# Altium project WELDER.PrjPcb
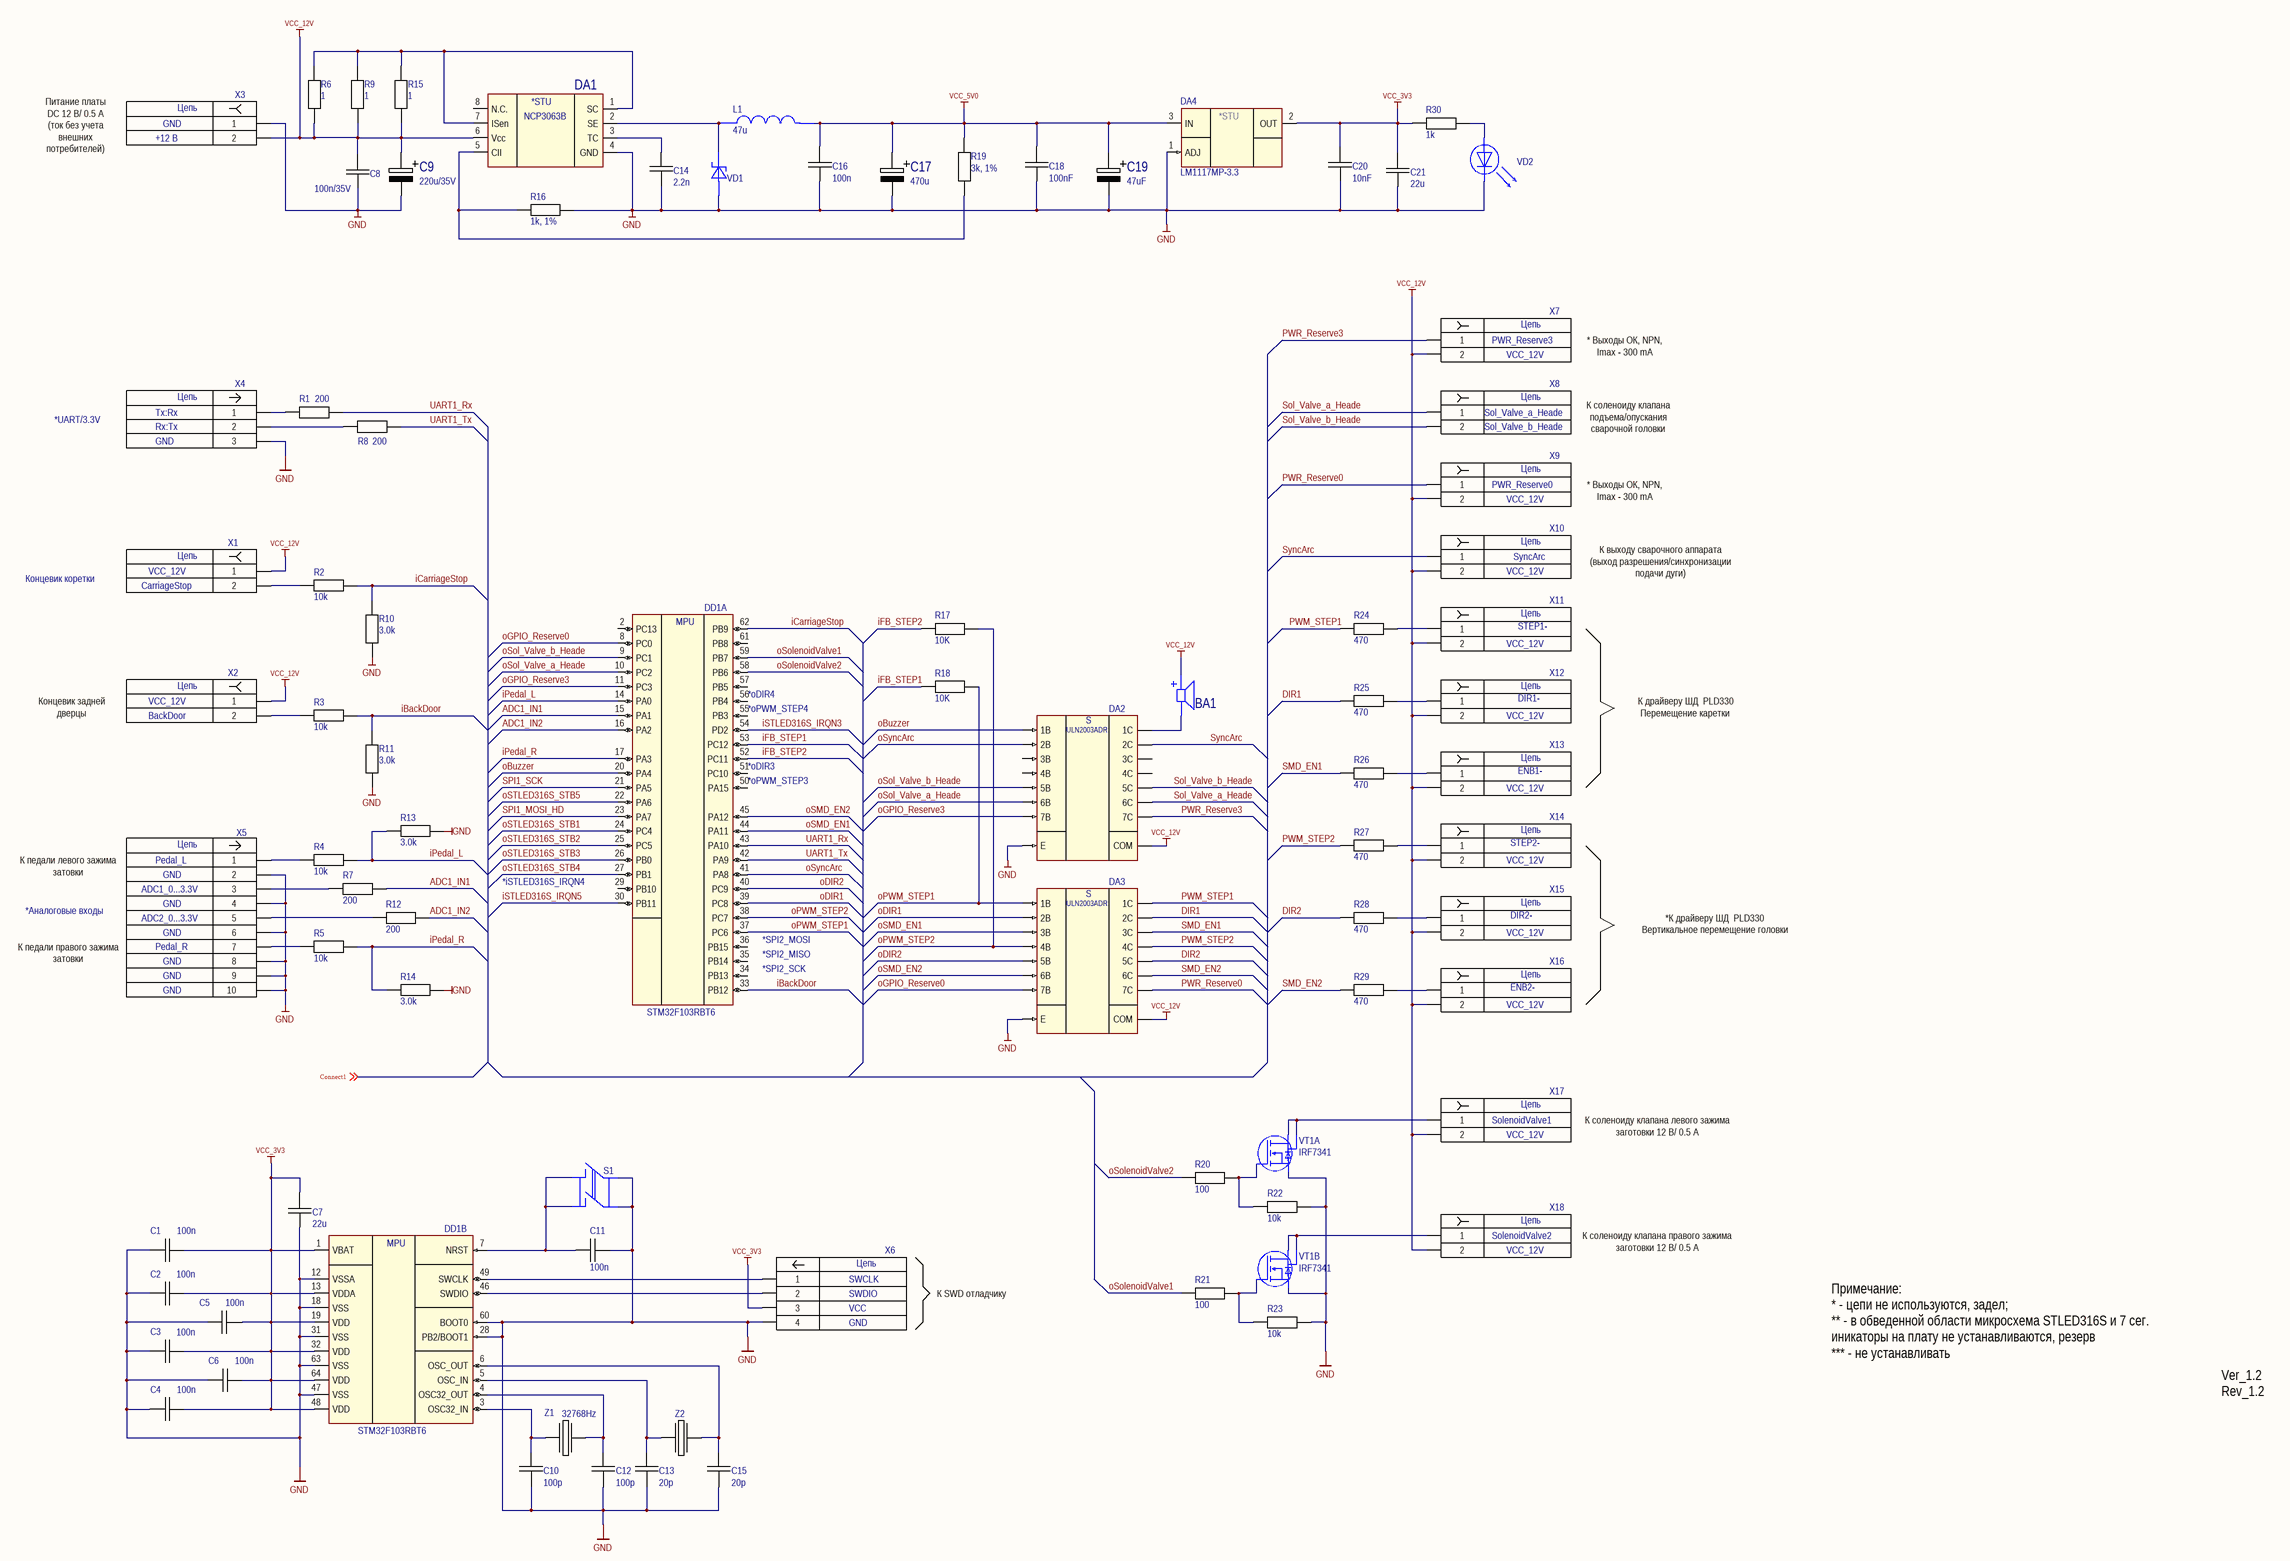
[diagram p0: Sheet1.SchDoc]
3 sheets, 154 parts. Net scope: global (net labels, ports and power ports of the same name join across sheets).
Board file: PCB1.PcbDoc
Sheets:
  Sheet1.SchDoc
  Sheet2.SchDoc
  Sheet3.SchDoc

## Sheet Sheet1.SchDoc
size 840 x 594 mm; Scale: 1:1; Разраб.: Тимофеев; Обозначение документа: 0000-00-00-01 Э3; Пров.: Тимофеев; Утв.: Тимофеев; Номер листа: 1; Общее количество листов: 2; Наименование организации: TSL; Перв. применение: 5759-05-12-20 УП6359; Наименование изделия 1: WELDER; Наименование изделия 2: Схема электрическая; Наименование изделия 3: принципиальная; Нач. отд.: Нач. отд.; Фамилия нач. отд.: Тимофеев

### Parts
BA1  Buzzer_HCM1212A  [Buzzer_HCM1212A]  (value not drawn)
C1  100n  [Capacitor_0805]
C2  100n  [Capacitor_0805]
C3  100n  [Capacitor_0805]
C4  100n  [Capacitor_0805]
C5  100n  [Capacitor_0805]
C6  100n  [Capacitor_0805]
C7  22u  [CAPACITOR_1206]
C8  100n/35V  [Capacitor_0805]
C9  220u/35V  [Capacitor_Electrolit_6.3x11]
C10  100p  [Capacitor_0805]  (no BOM)
C11  100n  [Capacitor_0805]
C12  100p  [Capacitor_0805]  (no BOM)
C13  20p  [Capacitor_0805]
C14  2.2n  [Capacitor_0805]
C15  20p  [Capacitor_0805]
C16  100n  [Capacitor_0805]
C17  470u  [Capacitor_Electrolit_6.3x11]
C18  100nF  [Capacitor_0805]
C19  47uF  [Capacitor_Electrolit_6.3x11]
C20  10nF  [Capacitor_0805]
C21  22u  [CAPACITOR_1206]
DA1  NCP3063B  [SOIC8]  (value not drawn)
DA2  ULN2003  [MCP3208_SOIC16]  (value not drawn)
DA3  ULN2003  [MCP3208_SOIC16]  (value not drawn)
DA4  LM1117MP-3.3  [NCP1117_SOT223]
DD1  STM32F103RBT6  [STM32F103RBT6_LQFP64]  (value not drawn)  (parts A,B of 2)
L1  47u  [INDUCTOR_CDRH8D28]
R1  200  [RESISTOR_SMD0805]
R2  10k  [RESISTOR_SMD0805]
R3  10k  [RESISTOR_SMD0805]
R4  10k  [RESISTOR_SMD0805]
R5  10k  [RESISTOR_SMD0805]
R6  1  [RESISTOR_SMD0805]
R7  200  [RESISTOR_SMD0805]
R8  200  [RESISTOR_SMD0805]
R9  1  [RESISTOR_SMD0805]
R10  3.0k  [RESISTOR_SMD0805]
R11  3.0k  [RESISTOR_SMD0805]
R12  200  [RESISTOR_SMD0805]
R13  3.0k  [RESISTOR_SMD0805]
R14  3.0k  [RESISTOR_SMD0805]
R15  1  [RESISTOR_SMD0805]
R16  1k, 1%  [RESISTOR_SMD0805]
R17  10K  [RESISTOR_SMD0805]
R18  10K  [RESISTOR_SMD0805]
R19  3k, 1%  [RESISTOR_SMD0805]
R20  100  [RESISTOR_SMD0805]
R21  100  [RESISTOR_SMD0805]
R22  10k  [RESISTOR_SMD0805]
R23  10k  [RESISTOR_SMD0805]
R24  470  [RESISTOR_SMD0805]
R25  470  [RESISTOR_SMD0805]
R26  470  [RESISTOR_SMD0805]
R27  470  [RESISTOR_SMD0805]
R28  470  [RESISTOR_SMD0805]
R29  470  [RESISTOR_SMD0805]
R30  1k  [RESISTOR_SMD0805]
S1  DTS-26 12x12x9.5  [Tact Switch_DTS-26_12x12x95]  (value not drawn)
VD1  STPS1L30A  [DIODE_STPS1L30A]  (value not drawn)
VD2  LED_FYL-3014GD1A  [LED_ FYL-3014GD1A]  (value not drawn)
VT1  IRF7341  [IRF7341_SO-8/SOIC-8]  (parts A,B of 2)
X1  Connector_DG306-5.0-02P  [CONNECTOR_DG306-5.0-02P]  (value not drawn)
X2  Connector_DG306-5.0-02P  [CONNECTOR_DG306-5.0-02P]  (value not drawn)
X3  Connector_DG306-5.0-02P  [CONNECTOR_DG306-5.0-02P]  (value not drawn)
X4  Connector_PLS-3  [CONNECTOR_PLS-3]  (value not drawn)
X5  Connector_PLD-10  [CONNECTOR_PLD-10]  (value not drawn)
X6  Connector_PLS-4  [CONNECTOR_PLS-4]  (value not drawn)
X7  Connector_DG306-5.0-02P  [CONNECTOR_DG306-5.0-02P]  (value not drawn)
X8  Connector_DG306-5.0-02P  [CONNECTOR_DG306-5.0-02P]  (value not drawn)
X9  Connector_DG306-5.0-02P  [CONNECTOR_DG306-5.0-02P]  (value not drawn)
X10  Connector_DG306-5.0-02P  [CONNECTOR_DG306-5.0-02P]  (value not drawn)
X11  Connector_DG306-5.0-02P  [CONNECTOR_DG306-5.0-02P]  (value not drawn)
X12  Connector_DG306-5.0-02P  [CONNECTOR_DG306-5.0-02P]  (value not drawn)
X13  Connector_DG306-5.0-02P  [CONNECTOR_DG306-5.0-02P]  (value not drawn)
X14  Connector_DG306-5.0-02P  [CONNECTOR_DG306-5.0-02P]  (value not drawn)
X15  Connector_DG306-5.0-02P  [CONNECTOR_DG306-5.0-02P]  (value not drawn)
X16  Connector_DG306-5.0-02P  [CONNECTOR_DG306-5.0-02P]  (value not drawn)
X17  Connector_DG306-5.0-02P  [CONNECTOR_DG306-5.0-02P]  (value not drawn)
X18  Connector_DG306-5.0-02P  [CONNECTOR_DG306-5.0-02P]  (value not drawn)
Z1  32768Hz  [Quartz_32768kHz]  (no BOM)
Z2  Quartz_KX-9A  [Quartz_KX-9]  (value not drawn)

### Nets
GND: C1.1 C2.1 C3.1 C4.1 C5.2 C6.1 C7.2 C8.2 C9.2 C10.1 C11.1 C12.1 C13.1 C14.1 C15.1 C16.2 C17.2 C18.2 C19.2 C20.2 C21.2 DA1.4(GND) DA2.8(E) DA3.8(E) DA4.1(ADJ) DD1.12(VSSA) DD1.18(VSS) DD1.28(PB2/BOOT1) DD1.31(VSS) DD1.47(VSS) DD1.60(BOOT0) DD1.63(VSS) R10.1 R11.1 R13.1 R14.1 R16.1 R22.1 R23.1 S1.3 S1.4 VD1.2 VD2.1 VT1.1 VT1.3 X3.1 X4.3 X5.2 X5.4 X5.6 X5.8 X5.9 X5.10 X6.4
VCC_3V3: C1.2 C2.2 C3.2 C4.2 C5.1 C6.2 C7.1 C20.1 C21.1 DA4.2(OUT) DD1.1(VBAT) DD1.13(VDDA) DD1.19(VDD) DD1.32(VDD) DD1.48(VDD) DD1.64(VDD) R30.2 X6.3
VCC_5V0: C16.1 C17.1 C18.1 C19.1 DA4.3(IN) L1.2 R19.1
VCC_12V: BA1.1 C8.1 C9.1 DA1.6(Vcc) DA2.9(COM) DA3.9(COM) R6.2 R9.2 R15.2 X1.1 X2.1 X3.2 X7.2 X9.2 X10.2 X11.2 X12.2 X13.2 X14.2 X15.2 X16.2 X17.2 X18.2
ADC1_IN1: DD1.15(PA1) R7.1
ADC1_IN2: DD1.16(PA2) R12.1
DIR1: DA3.15(2C) R25.2
DIR2: DA3.12(5C) R28.2
iBackDoor: DD1.33(PB12) R3.1 R11.2
iCarriageStop: DD1.62(PB9) R2.1 R10.2
iFB_STEP1: DD1.53(PC12) R18.1
iFB_STEP2: DD1.52(PC11) R17.1
iPedal_L: DD1.14(PA0) R4.1 R13.2
iPedal_R: DD1.17(PA3) R5.1 R14.2
iSTLED316S_IRQN3: DD1.54(PD2)
iSTLED316S_IRQN5: DD1.30(PB11)
oBuzzer: DA2.1(1B) DD1.20(PA4)
oDIR1: DA3.2(2B) DD1.39(PC8)
oDIR2: DA3.5(5B) DD1.40(PC9)
oGPIO_Reserve0: DA3.7(7B) DD1.8(PC0)
oGPIO_Reserve3: DA2.7(7B) DD1.11(PC3)
oPWM_STEP1: DA3.1(1B) DD1.37(PC6) R18.2
oPWM_STEP2: DA3.4(4B) DD1.38(PC7) R17.2
oSMD_EN1: DA3.3(3B) DD1.44(PA11)
oSMD_EN2: DA3.6(6B) DD1.45(PA12)
oSol_Valve_a_Heade: DA2.6(6B) DD1.10(PC2)
oSol_Valve_b_Heade: DA2.5(5B) DD1.9(PC1)
oSolenoidValve1: DD1.59(PB7) R21.2
oSolenoidValve2: DD1.58(PB6) R20.2
oSTLED316S_STB1: DD1.24(PC4)
oSTLED316S_STB2: DD1.25(PC5)
oSTLED316S_STB3: DD1.26(PB0)
oSTLED316S_STB4: DD1.27(PB1)
oSTLED316S_STB5: DD1.22(PA6)
oSyncArc: DA2.2(2B) DD1.41(PA8)
PWM_STEP1: DA3.16(1C) R24.2
PWM_STEP2: DA3.13(4C) R27.2
PWR_Reserve0: DA3.10(7C) X9.1
PWR_Reserve3: DA2.10(7C) X7.1
SMD_EN1: DA3.14(3C) R26.2
SMD_EN2: DA3.11(6C) R29.2
Sol_Valve_a_Heade: DA2.11(6C) X8.1
Sol_Valve_b_Heade: DA2.12(5C) X8.2
SPI1_MOSI_HD: DD1.23(PA7)
SPI1_SCK: DD1.21(PA5)
SyncArc: DA2.15(2C) X10.1
UART1_Rx: DD1.43(PA10) R1.1
UART1_Tx: DD1.42(PA9) R8.1
NetBA1_2: BA1.2 DA2.16(1C)
NetC10_2: C10.2 DD1.3(OSC32_IN) Z1.1
NetC11_2: C11.2 DD1.7(NRST) S1.1 S1.2
NetC12_2: C12.2 DD1.4(OSC32_OUT) Z1.2
NetC13_2: C13.2 DD1.5(OSC_IN) Z2.1
NetC14_2: C14.2 DA1.3(TC)
NetC15_2: C15.2 DD1.6(OSC_OUT) Z2.3
NetDA1_1: DA1.1(SC) DA1.7(ISen) R6.1 R9.1 R15.1
NetDA1_2: DA1.2(SE) L1.1 VD1.1
NetDA1_5: DA1.5(CII) R16.2 R19.2
NetDD1_46: DD1.46(SWDIO) X6.2
NetDD1_49: DD1.49(SWCLK) X6.1
NetR1_2: R1.2 X4.1
NetR2_2: R2.2 X1.2
NetR3_2: R3.2 X2.2
NetR4_2: R4.2 X5.1
NetR5_2: R5.2 X5.7
NetR7_2: R7.2 X5.3
NetR8_2: R8.2 X4.2
NetR12_2: R12.2 X5.5
NetR20_1: R20.1 R22.2 VT1.2
NetR21_1: R21.1 R23.2 VT1.4
NetR24_1: R24.1 X11.1
NetR25_1: R25.1 X12.1
NetR26_1: R26.1 X13.1
NetR27_1: R27.1 X14.1
NetR28_1: R28.1 X15.1
NetR29_1: R29.1 X16.1
NetR30_1: R30.1 VD2.2
NetVT1_5: VT1.5 VT1.6 X18.1
NetVT1_7: VT1.7 VT1.8 X17.1

Not connected (* = marked no-connect by the designer): DA1 8(N.C.); DA2 3(3B) 4(4B) 13(4C) 14(3C); DD1 2(PC13) 29(PB10) 34(PB13) 35(PB14) 36(PB15) 50(PA15) 51(PC10) 55(PB3) 56(PB4) 57(PB5) 61(PB8)

### Notes on the sheet
- Питание платы
  DC 12 В/ 0.5 А
  (ток без учета внешних потребителей)
- +12 В
- GND
- PWR_Reserve3
- VCC_12V
- * Выходы ОК, NPN,
  Imax - 300 mA
- *UART/3.3V
- Rx:Tx
- Tx:Rx
- Sol_Valve_a_Heade
- Sol_Valve_b_Heade
- К соленоиду клапана подъема/опускания сварочной головки
- PWR_Reserve0
- SyncArc
- Концевик коретки
- CarriageStop
- К выходу сварочного аппарата
  (выход разрешения/синхронизации подачи дуги)
- STEP1-
- (near DD1) *oDIR4
- DIR1-
- Концевик задней дверцы
- BackDoor
- (near DD1) *oPWM_STEP4
- К драйверу ШД  PLD330
  Перемещение каретки
- (near DD1) *oDIR3
- ENB1-
- (near DD1) *oPWM_STEP3
- STEP2-
- К педали левого зажима затовки
- Pedal_L
- *iSTLED316S_IRQN4
- *Аналоговые входы
- ADC1_0...3.3V
- ADC2_0...3.3V
- DIR2-
- К педали правого зажима затовки
- Pedal_R
- (near DD1) *SPI2_MOSI
- (near DD1) *SPI2_MISO
- *К драйверу ШД  PLD330
  Вертикальное перемещение головки
- (near DD1) *SPI2_SCK
- ENB2-
- SolenoidValve1
- К соленоиду клапана левого зажима заготовки 12 В/ 0.5 А
- SolenoidValve2
- К соленоиду клапана правого зажима заготовки 12 В/ 0.5 А
- SWCLK
- SWDIO
- VCC
- К SWD отладчику
- Примечание:
  * - цепи не используются, задел;
  ** - в обведенной области микросхема STLED316S и 7 сег. иникаторы на плату не устанавливаются, резерв
  *** - не устанавливать
- Ver_1.2
  Rev_1.2
- Перв. примен.
- Справ. №
- Подп. и дата
- Инв. № дубл.
- Взам. инв. №
- Разраб.
- Изм.
- Лист
- № докум.
- Подп.
- Дата
- Лит.
- Масса
- Масштаб
- Пров.
- Т.контр.
- Листов
- Инв. № подл.
- Утв.
- Н.контр.
- Копировал
- Формат А1
- (in symbol Connector_DG306-5.0-02P) Цепь
- (in symbol Connector_PLD-10) Цепь
- (in symbol Connector_PLS-3) Цепь
- (in symbol Connector_PLS-4) Цепь
- (in symbol LM1117MP-3.3) *STU
- (in symbol NCP3063B) *STU
- (in symbol STM32F103RBT6, part A) MPU
- (in symbol STM32F103RBT6, part B) MPU
- (in symbol ULN2003) S; ULN2003ADR

### Library data of the parts
C1-C6 C8 C10-C16 C18 C20 = Capacitor_0805
C7 C21 = Capacitor_1206
C9 C17 C19 = Capacitor+_6.3x11
L1 = Indluctor_CDRH8D28
R1-R30 = Resistor_0805
S1 = Tact_Switch_DTS-26_12x12x95
VD1 = Diode_STPS1L30A
Z1 = Quartz_32678Hz

## Sheet Sheet2.SchDoc
size 840 x 594 mm; Scale: 1:1; Разраб.: Тимофеев; Обозначение документа: 5759-05-12-20 УП6359 Э3; Пров.: Никоноров; Утв.: Токарев; Наименование организации: ООО "ПО"Зарница"; Перв. применение: 5759-05-12-20 УП6359; Наименование изделия 1: Uni_mp3_v2_00; Наименование изделия 2: Схема электрическая; Наименование изделия 3: принципиальная; Нач. отд.: Нач. отд.; Фамилия нач. отд.: Никоноров
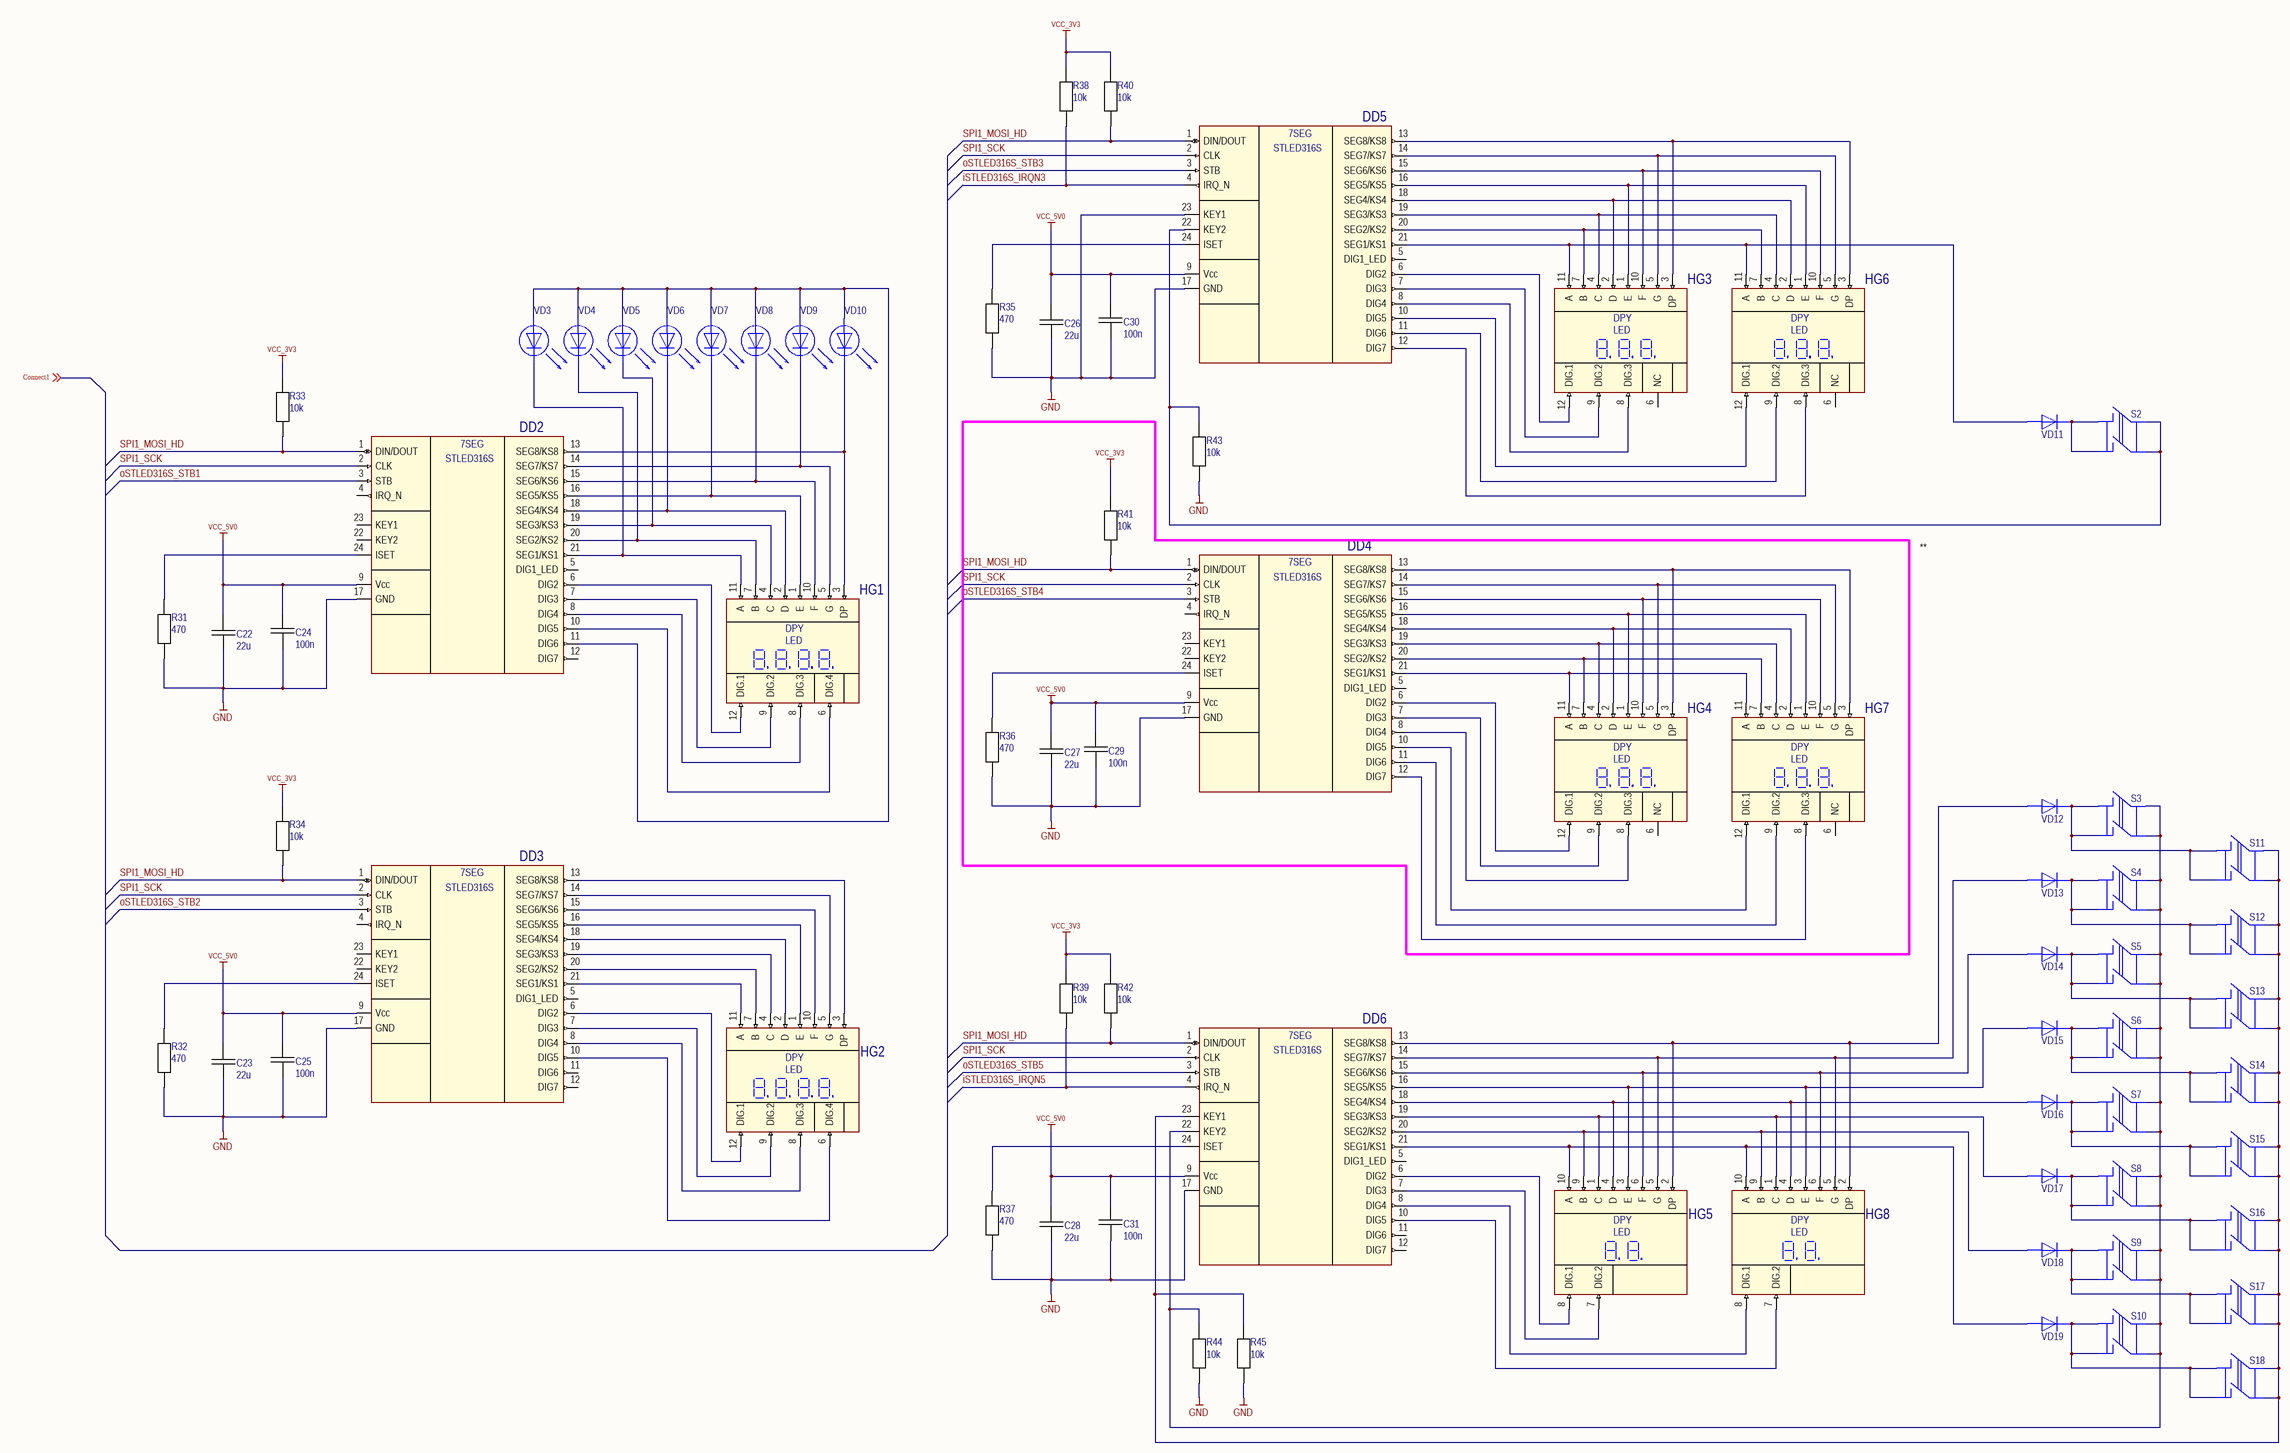
[diagram p1: Sheet2.SchDoc]

### Parts
C22  22u  [CAPACITOR_1206]
C23  22u  [CAPACITOR_1206]
C24  100n  [Capacitor_0805]
C25  100n  [Capacitor_0805]
C26  22u  [CAPACITOR_1206]
C27  22u  [CAPACITOR_1206]
C28  22u  [CAPACITOR_1206]
C29  100n  [Capacitor_0805]
C30  100n  [Capacitor_0805]
C31  100n  [Capacitor_0805]
DD2  STLED316S  [SO-24]  (value not drawn)
DD3  STLED316S  [SO-24]  (value not drawn)
DD4  STLED316S  [SO-24]  (value not drawn)
DD5  STLED316S  [SO-24]  (value not drawn)
DD6  STLED316S  [SO-24]  (value not drawn)
HG1  FYQ-5641BG-21  [FYQ-5641BG-21]  (value not drawn)
HG2  FYQ-5641BG-21  [FYQ-5641BG-21]  (value not drawn)
HG3  FYT-5631Bx  [FYT-5631Bx]  (value not drawn)
HG4  FYT-5631Bx  (value not drawn)
HG5  FYD-5621Bx  [FYD-5621Bx]  (value not drawn)
HG6  FYT-5631Bx  [FYT-5631Bx]  (value not drawn)
HG7  FYT-5631Bx  (value not drawn)
HG8  FYD-5621Bx  [FYD-5621Bx]  (value not drawn)
R31  470  [RESISTOR_SMD0805]
R32  470  [RESISTOR_SMD0805]
R33  10k  [RESISTOR_SMD0805]
R34  10k  [RESISTOR_SMD0805]
R35  470  [RESISTOR_SMD0805]
R36  470  [RESISTOR_SMD0805]
R37  470  [RESISTOR_SMD0805]
R38  10k  [RESISTOR_SMD0805]
R39  10k  [RESISTOR_SMD0805]
R40  10k  [RESISTOR_SMD0805]
R41  10k  [RESISTOR_SMD0805]
R42  10k  [RESISTOR_SMD0805]
R43  10k  [RESISTOR_SMD0805]
R44  10k  [RESISTOR_SMD0805]
R45  10k  [RESISTOR_SMD0805]
S2  DTS-26 12x12x9.5  [Tact Switch_DTS-26_12x12x95]  (value not drawn)
S3  DTS-26 12x12x9.5  [Tact Switch_DTS-26_12x12x95]  (value not drawn)
S4  DTS-26 12x12x9.5  [Tact Switch_DTS-26_12x12x95]  (value not drawn)
S5  DTS-26 12x12x9.5  [Tact Switch_DTS-26_12x12x95]  (value not drawn)
S6  DTS-26 12x12x9.5  [Tact Switch_DTS-26_12x12x95]  (value not drawn)
S7  DTS-26 12x12x9.5  [Tact Switch_DTS-26_12x12x95]  (value not drawn)
S8  DTS-26 12x12x9.5  [Tact Switch_DTS-26_12x12x95]  (value not drawn)
S9  DTS-26 12x12x9.5  [Tact Switch_DTS-26_12x12x95]  (value not drawn)
S10  DTS-26 12x12x9.5  [Tact Switch_DTS-26_12x12x95]  (value not drawn)
S11  DTS-26 12x12x9.5  [Tact Switch_DTS-26_12x12x95]  (value not drawn)
S12  DTS-26 12x12x9.5  [Tact Switch_DTS-26_12x12x95]  (value not drawn)
S13  DTS-26 12x12x9.5  [Tact Switch_DTS-26_12x12x95]  (value not drawn)
S14  DTS-26 12x12x9.5  [Tact Switch_DTS-26_12x12x95]  (value not drawn)
S15  DTS-26 12x12x9.5  [Tact Switch_DTS-26_12x12x95]  (value not drawn)
S16  DTS-26 12x12x9.5  [Tact Switch_DTS-26_12x12x95]  (value not drawn)
S17  DTS-26 12x12x9.5  [Tact Switch_DTS-26_12x12x95]  (value not drawn)
S18  DTS-26 12x12x9.5  [Tact Switch_DTS-26_12x12x95]  (value not drawn)
VD3  LED_FYL-3014GD1A  (value not drawn)
VD4  LED_FYL-3014GD1A  (value not drawn)
VD5  LED_FYL-3014GD1A  (value not drawn)
VD6  LED_FYL-3014GD1A  (value not drawn)
VD7  LED_FYL-3014GD1A  [LED_ FYL-3014GD1A]  (value not drawn)
VD8  LED_FYL-3014GD1A  [LED_ FYL-3014GD1A]  (value not drawn)
VD9  LED_FYL-3014GD1A  [LED_ FYL-3014GD1A]  (value not drawn)
VD10  LED_FYL-3014GD1A  [LED_ FYL-3014GD1A]  (value not drawn)
VD11  MMSD4148  [Diode_MMSD4148]  (value not drawn)
VD12  MMSD4148  [Diode_MMSD4148]  (value not drawn)
VD13  MMSD4148  [Diode_MMSD4148]  (value not drawn)
VD14  MMSD4148  [Diode_MMSD4148]  (value not drawn)
VD15  MMSD4148  [Diode_MMSD4148]  (value not drawn)
VD16  MMSD4148  [Diode_MMSD4148]  (value not drawn)
VD17  MMSD4148  [Diode_MMSD4148]  (value not drawn)
VD18  MMSD4148  [Diode_MMSD4148]  (value not drawn)
VD19  MMSD4148  [Diode_MMSD4148]  (value not drawn)

### Nets
GND: C22.2 C23.2 C24.1 C25.1 C26.2 C27.2 C28.2 C29.1 C30.1 C31.1 DD2.17(GND) DD3.17(GND) DD4.17(GND) DD5.17(GND) DD5.23(KEY1) DD6.17(GND) R31.1 R32.1 R35.1 R36.1 R37.1 R43.1 R44.1 R45.1
VCC_3V3: R33.2 R34.2 R38.2 R39.2 R40.2 R41.2 R42.2
VCC_5V0: C22.1 C23.1 C24.2 C25.2 C26.1 C27.1 C28.1 C29.2 C30.2 C31.2 DD2.9(Vcc) DD3.9(Vcc) DD4.9(Vcc) DD5.9(Vcc) DD6.9(Vcc)
iSTLED316S_IRQN3: DD5.4(IRQ_N) R38.1
iSTLED316S_IRQN5: DD6.4(IRQ_N) R39.1
oSTLED316S_STB1: DD2.3(STB)
oSTLED316S_STB2: DD3.3(STB)
oSTLED316S_STB3: DD5.3(STB)
oSTLED316S_STB4: DD4.3(STB)
oSTLED316S_STB5: DD6.3(STB)
SPI1_MOSI_HD: DD2.1(DIN/DOUT) DD3.1(DIN/DOUT) DD4.1(DIN/DOUT) DD5.1(DIN/DOUT) DD6.1(DIN/DOUT) R33.1 R34.1 R40.1 R41.1 R42.1
SPI1_SCK: DD2.2(CLK) DD3.2(CLK) DD4.2(CLK) DD5.2(CLK) DD6.2(CLK)
NetDD2_6: DD2.6(DIG2) HG1.12(DIG.1)
NetDD2_7: DD2.7(DIG3) HG1.9(DIG.2)
NetDD2_8: DD2.8(DIG4) HG1.8(DIG.3)
NetDD2_10: DD2.10(DIG5) HG1.6(DIG.4)
NetDD2_11: DD2.11(DIG6) VD3.2 VD4.2 VD5.2 VD6.2 VD7.2 VD8.2 VD9.2 VD10.2
NetDD2_13: DD2.13(SEG8/KS8) HG1.3(DP) VD10.1
NetDD2_14: DD2.14(SEG7/KS7) HG1.5(G) VD9.1
NetDD2_15: DD2.15(SEG6/KS6) HG1.10(F) VD8.1
NetDD2_16: DD2.16(SEG5/KS5) HG1.1(E) VD7.1
NetDD2_18: DD2.18(SEG4/KS4) HG1.2(D) VD6.1
NetDD2_19: DD2.19(SEG3/KS3) HG1.4(C) VD5.1
NetDD2_20: DD2.20(SEG2/KS2) HG1.7(B) VD4.1
NetDD2_21: DD2.21(SEG1/KS1) HG1.11(A) VD3.1
NetDD2_24: DD2.24(ISET) R31.2
NetDD3_6: DD3.6(DIG2) HG2.12(DIG.1)
NetDD3_7: DD3.7(DIG3) HG2.9(DIG.2)
NetDD3_8: DD3.8(DIG4) HG2.8(DIG.3)
NetDD3_10: DD3.10(DIG5) HG2.6(DIG.4)
NetDD3_13: DD3.13(SEG8/KS8) HG2.3(DP)
NetDD3_14: DD3.14(SEG7/KS7) HG2.5(G)
NetDD3_15: DD3.15(SEG6/KS6) HG2.10(F)
NetDD3_16: DD3.16(SEG5/KS5) HG2.1(E)
NetDD3_18: DD3.18(SEG4/KS4) HG2.2(D)
NetDD3_19: DD3.19(SEG3/KS3) HG2.4(C)
NetDD3_20: DD3.20(SEG2/KS2) HG2.7(B)
NetDD3_21: DD3.21(SEG1/KS1) HG2.11(A)
NetDD3_24: DD3.24(ISET) R32.2
NetDD4_6: DD4.6(DIG2) HG4.12(DIG.1)
NetDD4_7: DD4.7(DIG3) HG4.9(DIG.2)
NetDD4_8: DD4.8(DIG4) HG4.8(DIG.3)
NetDD4_10: DD4.10(DIG5) HG7.12(DIG.1)
NetDD4_11: DD4.11(DIG6) HG7.9(DIG.2)
NetDD4_12: DD4.12(DIG7) HG7.8(DIG.3)
NetDD4_13: DD4.13(SEG8/KS8) HG4.3(DP) HG7.3(DP)
NetDD4_14: DD4.14(SEG7/KS7) HG4.5(G) HG7.5(G)
NetDD4_15: DD4.15(SEG6/KS6) HG4.10(F) HG7.10(F)
NetDD4_16: DD4.16(SEG5/KS5) HG4.1(E) HG7.1(E)
NetDD4_18: DD4.18(SEG4/KS4) HG4.2(D) HG7.2(D)
NetDD4_19: DD4.19(SEG3/KS3) HG4.4(C) HG7.4(C)
NetDD4_20: DD4.20(SEG2/KS2) HG4.7(B) HG7.7(B)
NetDD4_21: DD4.21(SEG1/KS1) HG4.11(A) HG7.11(A)
NetDD4_24: DD4.24(ISET) R36.2
NetDD5_6: DD5.6(DIG2) HG3.12(DIG.1)
NetDD5_7: DD5.7(DIG3) HG3.9(DIG.2)
NetDD5_8: DD5.8(DIG4) HG3.8(DIG.3)
NetDD5_10: DD5.10(DIG5) HG6.12(DIG.1)
NetDD5_11: DD5.11(DIG6) HG6.9(DIG.2)
NetDD5_12: DD5.12(DIG7) HG6.8(DIG.3)
NetDD5_13: DD5.13(SEG8/KS8) HG3.3(DP) HG6.3(DP)
NetDD5_14: DD5.14(SEG7/KS7) HG3.5(G) HG6.5(G)
NetDD5_15: DD5.15(SEG6/KS6) HG3.10(F) HG6.10(F)
NetDD5_16: DD5.16(SEG5/KS5) HG3.1(E) HG6.1(E)
NetDD5_18: DD5.18(SEG4/KS4) HG3.2(D) HG6.2(D)
NetDD5_19: DD5.19(SEG3/KS3) HG3.4(C) HG6.4(C)
NetDD5_20: DD5.20(SEG2/KS2) HG3.7(B) HG6.7(B)
NetDD5_21: DD5.21(SEG1/KS1) HG3.11(A) HG6.11(A) VD11.2
NetDD5_22: DD5.22(KEY2) R43.2 S2.3 S2.4
NetDD5_24: DD5.24(ISET) R35.2
NetDD6_6: DD6.6(DIG2) HG5.8(DIG.1)
NetDD6_7: DD6.7(DIG3) HG5.7(DIG.2)
NetDD6_8: DD6.8(DIG4) HG8.8(DIG.1)
NetDD6_10: DD6.10(DIG5) HG8.7(DIG.2)
NetDD6_13: DD6.13(SEG8/KS8) HG5.2(DP) HG8.2(DP) VD12.2
NetDD6_14: DD6.14(SEG7/KS7) HG5.5(G) HG8.5(G) VD13.2
NetDD6_15: DD6.15(SEG6/KS6) HG5.6(F) HG8.6(F) VD14.2
NetDD6_16: DD6.16(SEG5/KS5) HG5.3(E) HG8.3(E) VD15.2
NetDD6_18: DD6.18(SEG4/KS4) HG5.4(D) HG8.4(D) VD16.2
NetDD6_19: DD6.19(SEG3/KS3) HG5.1(C) HG8.1(C) VD17.2
NetDD6_20: DD6.20(SEG2/KS2) HG5.9(B) HG8.9(B) VD18.2
NetDD6_21: DD6.21(SEG1/KS1) HG5.10(A) HG8.10(A) VD19.2
NetDD6_22: DD6.22(KEY2) R44.2 S3.3 S3.4 S4.3 S4.4 S5.3 S5.4 S6.3 S6.4 S7.3 S7.4 S8.3 S8.4 S9.3 S9.4 S10.3 S10.4
NetDD6_23: DD6.23(KEY1) R45.2 S11.3 S11.4 S12.3 S12.4 S13.3 S13.4 S14.3 S14.4 S15.3 S15.4 S16.3 S16.4 S17.3 S17.4 S18.3 S18.4
NetDD6_24: DD6.24(ISET) R37.2
NetS2_1: S2.1 S2.2 VD11.1
NetS3_1: S3.1 S3.2 S11.1 S11.2 VD12.1
NetS4_1: S4.1 S4.2 S12.1 S12.2 VD13.1
NetS5_1: S5.1 S5.2 S13.1 S13.2 VD14.1
NetS6_1: S6.1 S6.2 S14.1 S14.2 VD15.1
NetS7_1: S7.1 S7.2 S15.1 S15.2 VD16.1
NetS8_1: S8.1 S8.2 S16.1 S16.2 VD17.1
NetS9_1: S9.1 S9.2 S17.1 S17.2 VD18.1
NetS10_1: S10.1 S10.2 S18.1 S18.2 VD19.1

Not connected (* = marked no-connect by the designer): DD2 4(IRQ_N) 5(DIG1_LED) 12(DIG7) 22(KEY2) 23(KEY1); DD3 4(IRQ_N) 5(DIG1_LED) 11(DIG6) 12(DIG7) 22(KEY2) 23(KEY1); DD4 4(IRQ_N) 5(DIG1_LED) 22(KEY2) 23(KEY1); DD5 5(DIG1_LED); DD6 5(DIG1_LED) 11(DIG6) 12(DIG7); HG3 6(NC); HG4 6(NC); HG6 6(NC); HG7 6(NC)

### Notes on the sheet
- (near R40) ***
- (near R33) ***
- (near R41) ***
- **
- (near R34) ***
- Подп. и дата
- Инв. № дубл.
- Взам. инв. №
- Инв. № подл.
- Изм.
- Лист
- № докум.
- Подп.
- Дата
- Копировал
- Формат А1
- (in symbol FYD-5621Bx) DPY; LED
- (in symbol FYQ-5641BG-21) DPY; LED
- (in symbol FYT-5631Bx) DPY; LED
- (in symbol STLED316S) 7SEG

### Library data of the parts
C22 C23 C26-C28 = Capacitor_1206
C24 C25 C29-C31 = Capacitor_0805
R31-R45 = Resistor_0805
S2-S18 = Tact_Switch_DTS-26_12x12x95
VD11-VD19 = Diode_MMSD4148

## Sheet Sheet3.SchDoc
size 297 x 420 mm; Scale: 1:1; Разраб.: Тимофеев; Обозначение документа: 0000-00-00-001 Э5; Пров.: Тимофеев; Наименование организации: TSL; Перв. применение: 0000-00-00-001; Наименование изделия 1: WELDER; Наименование изделия 2: Схема электрическая; Наименование изделия 3: подключения; Нач. отд.: Нач. отд.
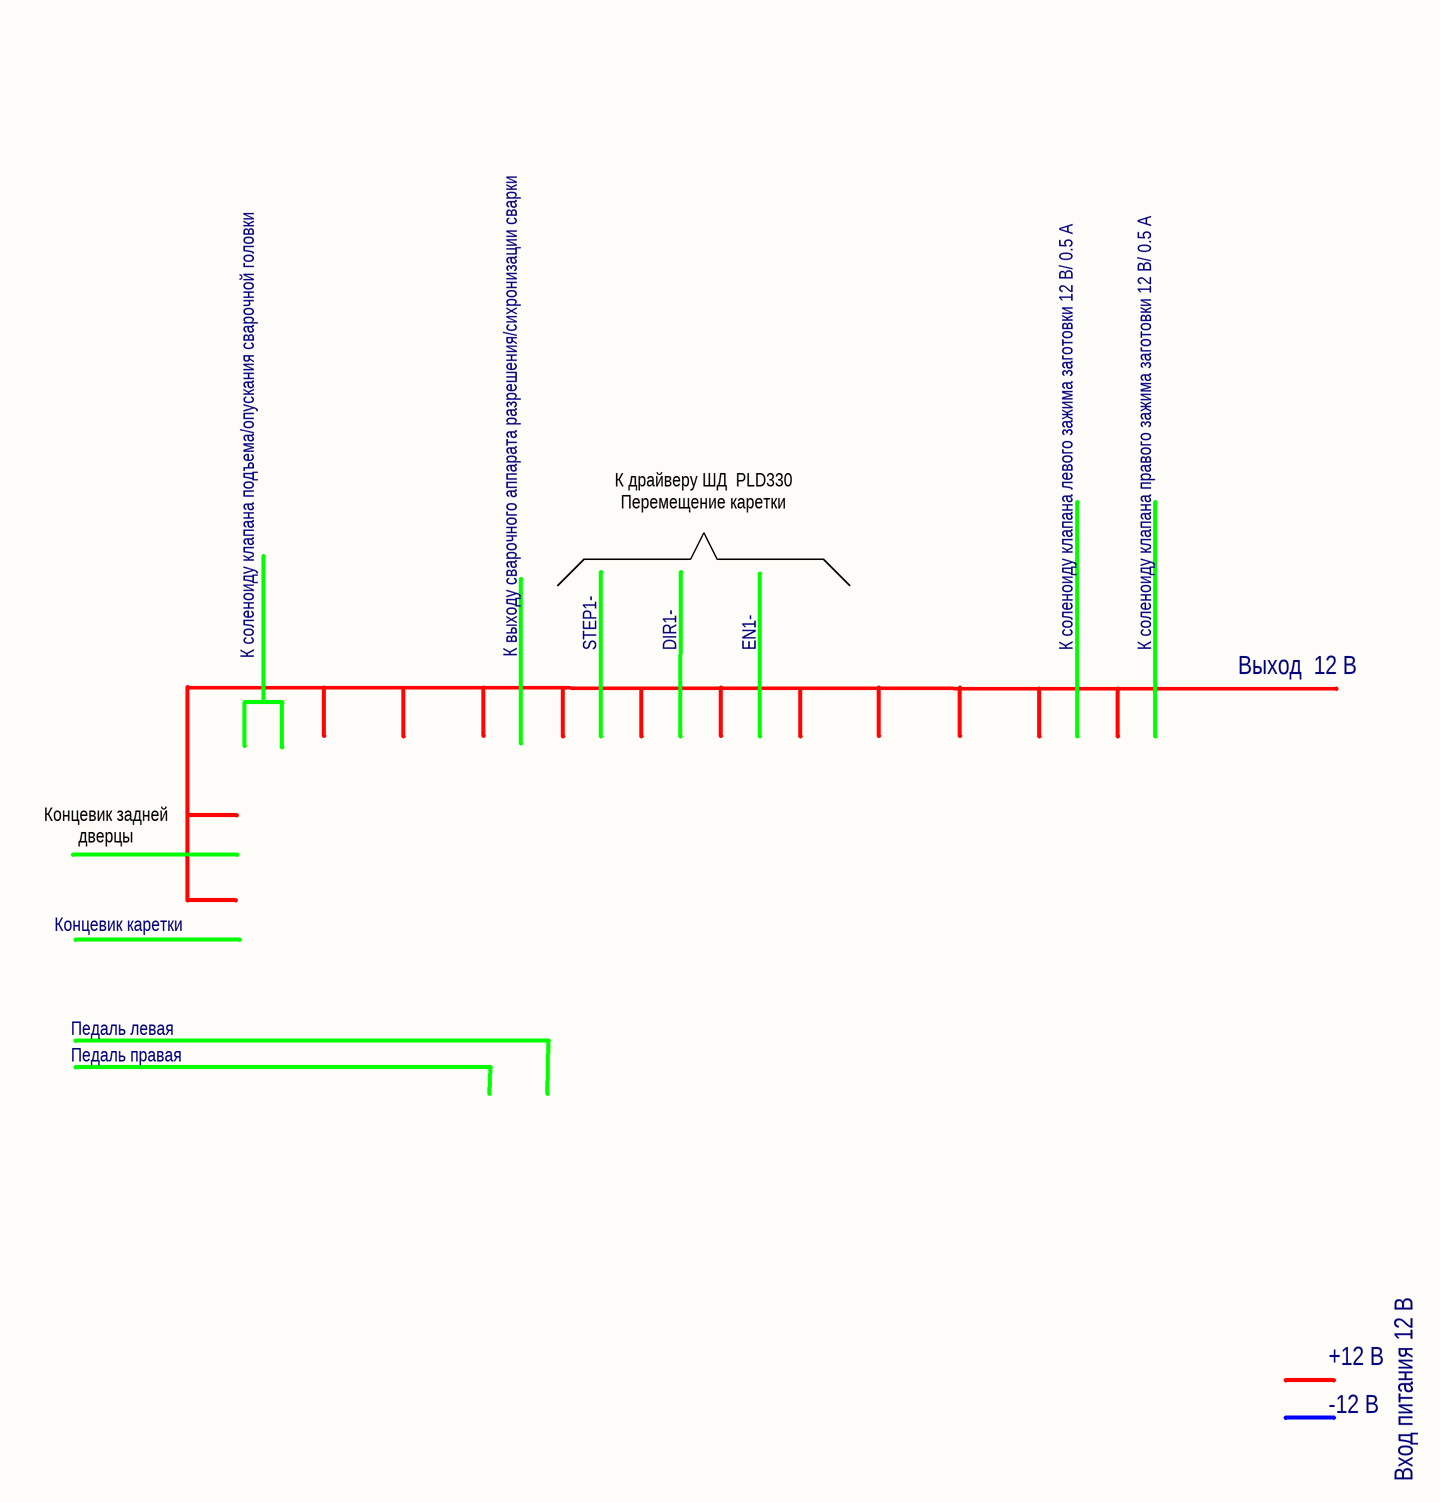
[diagram p2: Sheet3.SchDoc]

### Notes on the sheet
- К драйверу ШД  PLD330
  Перемещение каретки
- К соленоиду клапана подъема/опускания сварочной головки
- К выходу сварочного аппарата разрешения/сихронизации сварки
- STEP1-
- DIR1-
- EN1-
- К соленоиду клапана левого зажима заготовки 12 В/ 0.5 А
- К соленоиду клапана правого зажима заготовки 12 В/ 0.5 А
- Выход  12 В
- Концевик задней дверцы
- Концевик каретки
- Педаль левая
- Педаль правая
- +12 В
- -12 В
- Вход питания 12 В
- Перв. примен.
- Справ. №
- Подп. и дата
- Инв. № дубл.
- Взам. инв. №
- Разраб.
- Изм.
- Лист
- № докум.
- Подп.
- Дата
- Лит.
- Масса
- Масштаб
- Пров.
- Т.контр.
- Листов
- Инв. № подл.
- Утв.
- Н.контр.
- Копировал
- Формат А3

## Nets that join several sheets
GND: Sheet1 (54 pins), Sheet2 (24 pins)
VCC_3V3: Sheet1 (18 pins), Sheet2 (7 pins)
VCC_5V0: Sheet1 (7 pins), Sheet2 (15 pins)
iSTLED316S_IRQN3: Sheet1 (DD1.54), Sheet2 (DD5.4 R38.1)
iSTLED316S_IRQN5: Sheet1 (DD1.30), Sheet2 (DD6.4 R39.1)
oSTLED316S_STB1: Sheet1 (DD1.24), Sheet2 (DD2.3)
oSTLED316S_STB2: Sheet1 (DD1.25), Sheet2 (DD3.3)
oSTLED316S_STB3: Sheet1 (DD1.26), Sheet2 (DD5.3)
oSTLED316S_STB4: Sheet1 (DD1.27), Sheet2 (DD4.3)
oSTLED316S_STB5: Sheet1 (DD1.22), Sheet2 (DD6.3)
SPI1_MOSI_HD: Sheet1 (DD1.23), Sheet2 (10 pins)
SPI1_SCK: Sheet1 (DD1.21), Sheet2 (5 pins)

## Assembly variants
No fitteD: not fitted C10 C12 HG4 HG7 Z1